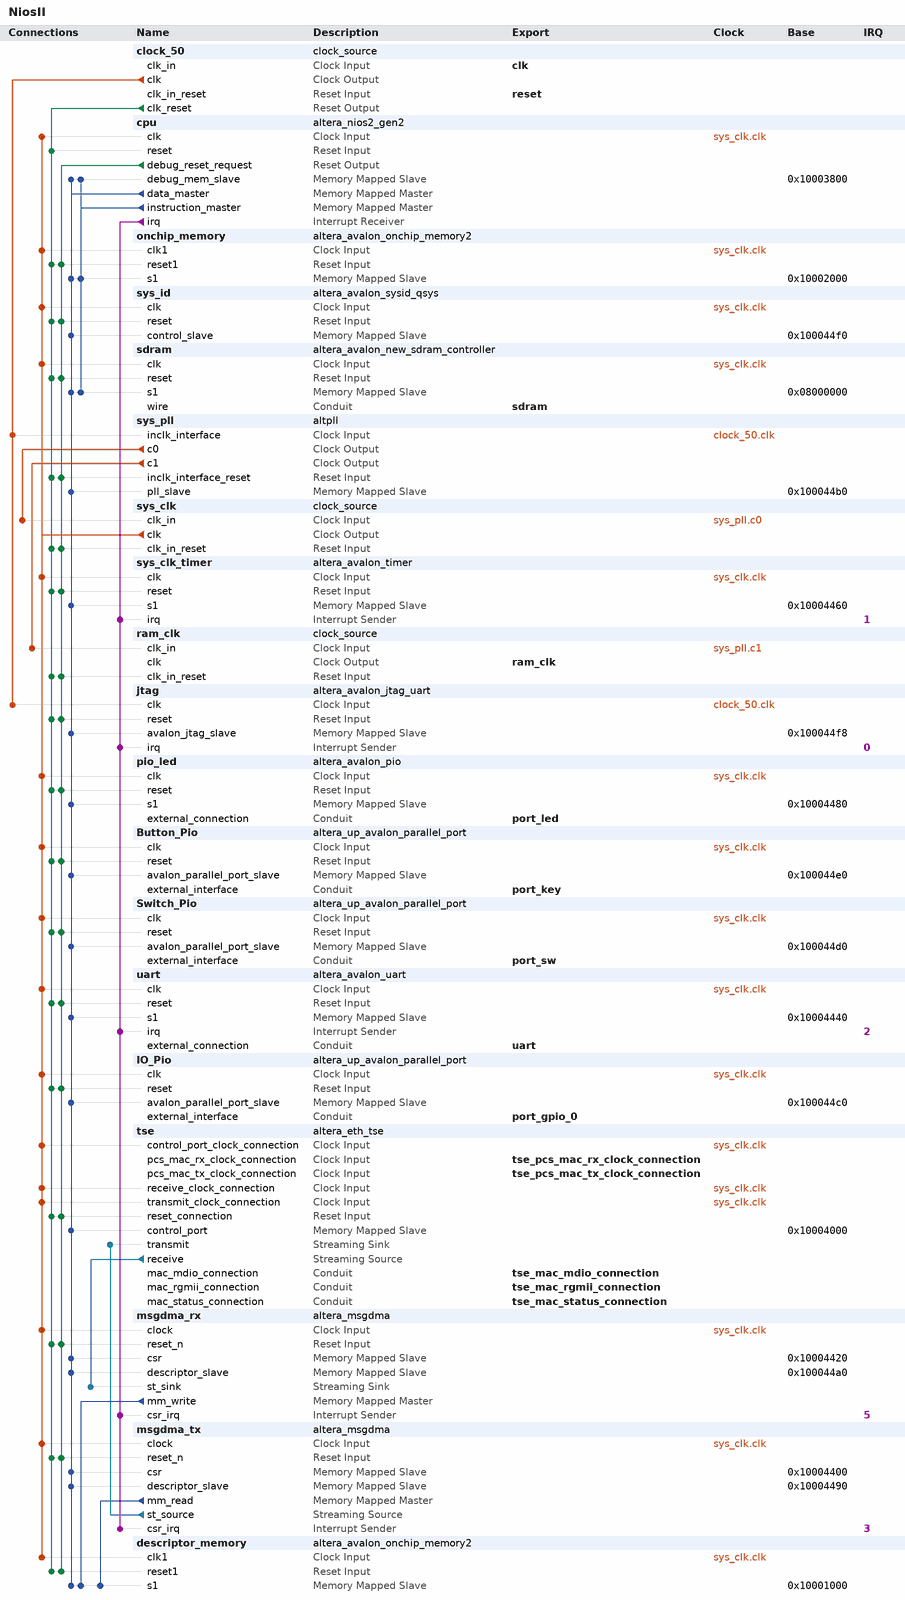
[diagram p0: system contents]
# Platform Designer (Qsys) system NiosII, Cyclone IV E EP4CE115F29C7
# Parameters at their usual value, and those the tool derives, are not listed.
package require -exact qsys 18.1
create_system NiosII
set_project_property DEVICE_FAMILY {Cyclone IV E}
set_project_property DEVICE EP4CE115F29C7

add_instance clock_50 clock_source 18.1
set_instance_parameter_value clock_50 clockFrequency 50000000

add_instance cpu altera_nios2_gen2 18.1
set_instance_parameter_value cpu dcache_size 2048
set_instance_parameter_value cpu exceptionSlave sdram.s1
set_instance_parameter_value cpu icache_size 4096
set_instance_parameter_value cpu impl Tiny
set_instance_parameter_value cpu resetSlave sdram.s1

add_instance onchip_memory altera_avalon_onchip_memory2 18.1
set_instance_parameter_value onchip_memory dataWidth 32
set_instance_parameter_value onchip_memory dualPort false
set_instance_parameter_value onchip_memory initMemContent true
set_instance_parameter_value onchip_memory initializationFileName onchip_mem.hex
set_instance_parameter_value onchip_memory memorySize 4096

add_instance sys_id altera_avalon_sysid_qsys 18.1
set_instance_parameter_value sys_id id 0

add_instance sdram altera_avalon_new_sdram_controller 18.1
set_instance_parameter_value sdram TAC 5.5
set_instance_parameter_value sdram TRCD 20.0
set_instance_parameter_value sdram TRP 20.0
set_instance_parameter_value sdram casLatency 3
set_instance_parameter_value sdram columnWidth 10
set_instance_parameter_value sdram dataWidth 32
set_instance_parameter_value sdram generateSimulationModel false
set_instance_parameter_value sdram model single_Micron_MT48LC4M32B2_7_chip
set_instance_parameter_value sdram numberOfBanks 4
set_instance_parameter_value sdram numberOfChipSelects 1
set_instance_parameter_value sdram powerUpDelay 100.0
set_instance_parameter_value sdram refreshPeriod 15.625
set_instance_parameter_value sdram rowWidth 13

add_instance sys_pll altpll 18.1
set_instance_parameter_value sys_pll CLK0_DIVIDE_BY 1
set_instance_parameter_value sys_pll CLK0_MULTIPLY_BY 2
set_instance_parameter_value sys_pll CLK1_DIVIDE_BY 1
set_instance_parameter_value sys_pll CLK1_DUTY_CYCLE 50
set_instance_parameter_value sys_pll CLK1_MULTIPLY_BY 2
set_instance_parameter_value sys_pll CLK1_PHASE_SHIFT -1667
set_instance_parameter_value sys_pll INCLK0_INPUT_FREQUENCY 20000
set_instance_parameter_value sys_pll PORT_ARESET PORT_UNUSED
set_instance_parameter_value sys_pll PORT_LOCKED PORT_UNUSED
set_instance_parameter_value sys_pll PORT_clk1 PORT_USED
set_instance_parameter_value sys_pll PORT_clk2 PORT_UNUSED
set_instance_parameter_value sys_pll PORT_clk3 PORT_UNUSED

add_instance sys_clk clock_source 18.1
set_instance_parameter_value sys_clk clockFrequency 100000000

add_instance sys_clk_timer altera_avalon_timer 18.1
set_instance_parameter_value sys_clk_timer fixedPeriod true
set_instance_parameter_value sys_clk_timer period 1
set_instance_parameter_value sys_clk_timer periodUnits MSEC

add_instance ram_clk clock_source 18.1
set_instance_parameter_value ram_clk clockFrequency 100000000

add_instance jtag altera_avalon_jtag_uart 18.1
set_instance_parameter_value jtag simInteractiveOptions NO_INTERACTIVE_WINDOWS

add_instance pio_led altera_avalon_pio 18.1
set_instance_parameter_value pio_led direction Output
set_instance_parameter_value pio_led width 8

add_instance Button_Pio altera_up_avalon_parallel_port 18.0
set_instance_parameter_value Button_Pio board DE0-Nano
set_instance_parameter_value Button_Pio capture false
set_instance_parameter_value Button_Pio edge Rising
set_instance_parameter_value Button_Pio irq false
set_instance_parameter_value Button_Pio preset Pushbuttons

add_instance Switch_Pio altera_up_avalon_parallel_port 18.0
set_instance_parameter_value Switch_Pio board DE0-Nano
set_instance_parameter_value Switch_Pio capture false
set_instance_parameter_value Switch_Pio edge Rising
set_instance_parameter_value Switch_Pio irq false
set_instance_parameter_value Switch_Pio preset {Dip Switches}

add_instance uart altera_avalon_uart 18.1
set_instance_parameter_value uart baud 115200
set_instance_parameter_value uart dataBits 8
set_instance_parameter_value uart fixedBaud true
set_instance_parameter_value uart parity NONE
set_instance_parameter_value uart stopBits 1

add_instance IO_Pio altera_up_avalon_parallel_port 18.0
set_instance_parameter_value IO_Pio board DE0-Nano
set_instance_parameter_value IO_Pio capture true
set_instance_parameter_value IO_Pio edge Rising
set_instance_parameter_value IO_Pio irq false
set_instance_parameter_value IO_Pio preset {Expansion Header}

add_instance tse altera_eth_tse 18.1
set_instance_parameter_value tse XCVR_RCFG_JTAG_ENABLE 0
set_instance_parameter_value tse XCVR_SET_CAPABILITY_REG_ENABLE 0
set_instance_parameter_value tse XCVR_SET_CSR_SOFT_LOGIC_ENABLE 0
set_instance_parameter_value tse XCVR_SET_PRBS_SOFT_LOGIC_ENABLE 0
set_instance_parameter_value tse XCVR_SET_USER_IDENTIFIER 0
set_instance_parameter_value tse core_variation MAC_ONLY
set_instance_parameter_value tse enable_hd_logic true
set_instance_parameter_value tse enable_mac_flow_ctrl false
set_instance_parameter_value tse enable_magic_detect true
set_instance_parameter_value tse enable_shift16 true
set_instance_parameter_value tse ifGMII RGMII
set_instance_parameter_value tse ing_addr 11
set_instance_parameter_value tse mdio_clk_div 40
set_instance_parameter_value tse stat_cnt_ena true
set_instance_parameter_value tse transceiver_type NONE

add_instance msgdma_rx altera_msgdma 18.1
set_instance_parameter_value msgdma_rx BURST_ENABLE 0
set_instance_parameter_value msgdma_rx DATA_FIFO_DEPTH 32
set_instance_parameter_value msgdma_rx DATA_WIDTH 32
set_instance_parameter_value msgdma_rx DESCRIPTOR_FIFO_DEPTH 128
set_instance_parameter_value msgdma_rx ENHANCED_FEATURES 0
set_instance_parameter_value msgdma_rx ERROR_ENABLE 0
set_instance_parameter_value msgdma_rx MAX_BURST_COUNT 2
set_instance_parameter_value msgdma_rx MAX_BYTE 1024
set_instance_parameter_value msgdma_rx MODE 2
set_instance_parameter_value msgdma_rx PACKET_ENABLE 1
set_instance_parameter_value msgdma_rx TRANSFER_TYPE {Aligned Accesses}

add_instance msgdma_tx altera_msgdma 18.1
set_instance_parameter_value msgdma_tx BURST_ENABLE 0
set_instance_parameter_value msgdma_tx DATA_FIFO_DEPTH 64
set_instance_parameter_value msgdma_tx DATA_WIDTH 32
set_instance_parameter_value msgdma_tx DESCRIPTOR_FIFO_DEPTH 128
set_instance_parameter_value msgdma_tx ENHANCED_FEATURES 0
set_instance_parameter_value msgdma_tx ERROR_ENABLE 0
set_instance_parameter_value msgdma_tx MAX_BURST_COUNT 2
set_instance_parameter_value msgdma_tx MAX_BYTE 1024
set_instance_parameter_value msgdma_tx MODE 1
set_instance_parameter_value msgdma_tx PACKET_ENABLE 1
set_instance_parameter_value msgdma_tx TRANSFER_TYPE {Aligned Accesses}

add_instance descriptor_memory altera_avalon_onchip_memory2 18.1
set_instance_parameter_value descriptor_memory dataWidth 32
set_instance_parameter_value descriptor_memory dualPort false
set_instance_parameter_value descriptor_memory initMemContent true
set_instance_parameter_value descriptor_memory initializationFileName onchip_mem.hex
set_instance_parameter_value descriptor_memory memorySize 4096

# connections
add_connection clock_50.clk jtag.clk clock
add_connection clock_50.clk sys_pll.inclk_interface clock
add_connection sys_clk.clk Button_Pio.clk clock
add_connection sys_clk.clk cpu.clk clock
add_connection sys_clk.clk descriptor_memory.clk1 clock
add_connection sys_clk.clk IO_Pio.clk clock
add_connection sys_clk.clk msgdma_rx.clock clock
add_connection sys_clk.clk msgdma_tx.clock clock
add_connection sys_clk.clk onchip_memory.clk1 clock
add_connection sys_clk.clk pio_led.clk clock
add_connection sys_clk.clk sdram.clk clock
add_connection sys_clk.clk Switch_Pio.clk clock
add_connection sys_clk.clk sys_clk_timer.clk clock
add_connection sys_clk.clk sys_id.clk clock
add_connection sys_clk.clk tse.control_port_clock_connection clock
add_connection sys_clk.clk tse.receive_clock_connection clock
add_connection sys_clk.clk tse.transmit_clock_connection clock
add_connection sys_clk.clk uart.clk clock
add_connection sys_pll.c0 sys_clk.clk_in clock
add_connection sys_pll.c1 ram_clk.clk_in clock
add_connection clock_50.clk_reset Button_Pio.reset reset
add_connection clock_50.clk_reset cpu.reset reset
add_connection clock_50.clk_reset descriptor_memory.reset1 reset
add_connection clock_50.clk_reset IO_Pio.reset reset
add_connection clock_50.clk_reset jtag.reset reset
add_connection clock_50.clk_reset msgdma_rx.reset_n reset
add_connection clock_50.clk_reset msgdma_tx.reset_n reset
add_connection clock_50.clk_reset onchip_memory.reset1 reset
add_connection clock_50.clk_reset pio_led.reset reset
add_connection clock_50.clk_reset ram_clk.clk_in_reset reset
add_connection clock_50.clk_reset sdram.reset reset
add_connection clock_50.clk_reset Switch_Pio.reset reset
add_connection clock_50.clk_reset sys_clk.clk_in_reset reset
add_connection clock_50.clk_reset sys_clk_timer.reset reset
add_connection clock_50.clk_reset sys_id.reset reset
add_connection clock_50.clk_reset sys_pll.inclk_interface_reset reset
add_connection clock_50.clk_reset tse.reset_connection reset
add_connection clock_50.clk_reset uart.reset reset
add_connection cpu.debug_reset_request Button_Pio.reset reset
add_connection cpu.debug_reset_request descriptor_memory.reset1 reset
add_connection cpu.debug_reset_request IO_Pio.reset reset
add_connection cpu.debug_reset_request jtag.reset reset
add_connection cpu.debug_reset_request msgdma_rx.reset_n reset
add_connection cpu.debug_reset_request msgdma_tx.reset_n reset
add_connection cpu.debug_reset_request onchip_memory.reset1 reset
add_connection cpu.debug_reset_request pio_led.reset reset
add_connection cpu.debug_reset_request ram_clk.clk_in_reset reset
add_connection cpu.debug_reset_request sdram.reset reset
add_connection cpu.debug_reset_request Switch_Pio.reset reset
add_connection cpu.debug_reset_request sys_clk.clk_in_reset reset
add_connection cpu.debug_reset_request sys_clk_timer.reset reset
add_connection cpu.debug_reset_request sys_id.reset reset
add_connection cpu.debug_reset_request sys_pll.inclk_interface_reset reset
add_connection cpu.debug_reset_request tse.reset_connection reset
add_connection cpu.debug_reset_request uart.reset reset
add_connection cpu.data_master Button_Pio.avalon_parallel_port_slave avalon
set_connection_parameter_value cpu.data_master/Button_Pio.avalon_parallel_port_slave baseAddress 0x100044e0
add_connection cpu.data_master cpu.debug_mem_slave avalon
set_connection_parameter_value cpu.data_master/cpu.debug_mem_slave baseAddress 0x10003800
add_connection cpu.data_master descriptor_memory.s1 avalon
set_connection_parameter_value cpu.data_master/descriptor_memory.s1 baseAddress 0x10001000
add_connection cpu.data_master IO_Pio.avalon_parallel_port_slave avalon
set_connection_parameter_value cpu.data_master/IO_Pio.avalon_parallel_port_slave baseAddress 0x100044c0
add_connection cpu.data_master jtag.avalon_jtag_slave avalon
set_connection_parameter_value cpu.data_master/jtag.avalon_jtag_slave baseAddress 0x100044f8
add_connection cpu.data_master msgdma_rx.csr avalon
set_connection_parameter_value cpu.data_master/msgdma_rx.csr baseAddress 0x10004420
add_connection cpu.data_master msgdma_rx.descriptor_slave avalon
set_connection_parameter_value cpu.data_master/msgdma_rx.descriptor_slave baseAddress 0x100044a0
add_connection cpu.data_master msgdma_tx.csr avalon
set_connection_parameter_value cpu.data_master/msgdma_tx.csr baseAddress 0x10004400
add_connection cpu.data_master msgdma_tx.descriptor_slave avalon
set_connection_parameter_value cpu.data_master/msgdma_tx.descriptor_slave baseAddress 0x10004490
add_connection cpu.data_master onchip_memory.s1 avalon
set_connection_parameter_value cpu.data_master/onchip_memory.s1 baseAddress 0x10002000
add_connection cpu.data_master pio_led.s1 avalon
set_connection_parameter_value cpu.data_master/pio_led.s1 baseAddress 0x10004480
add_connection cpu.data_master sdram.s1 avalon
set_connection_parameter_value cpu.data_master/sdram.s1 baseAddress 0x08000000
add_connection cpu.data_master Switch_Pio.avalon_parallel_port_slave avalon
set_connection_parameter_value cpu.data_master/Switch_Pio.avalon_parallel_port_slave baseAddress 0x100044d0
add_connection cpu.data_master sys_clk_timer.s1 avalon
set_connection_parameter_value cpu.data_master/sys_clk_timer.s1 baseAddress 0x10004460
add_connection cpu.data_master sys_id.control_slave avalon
set_connection_parameter_value cpu.data_master/sys_id.control_slave baseAddress 0x100044f0
add_connection cpu.data_master sys_pll.pll_slave avalon
set_connection_parameter_value cpu.data_master/sys_pll.pll_slave baseAddress 0x100044b0
add_connection cpu.data_master tse.control_port avalon
set_connection_parameter_value cpu.data_master/tse.control_port baseAddress 0x10004000
add_connection cpu.data_master uart.s1 avalon
set_connection_parameter_value cpu.data_master/uart.s1 baseAddress 0x10004440
add_connection cpu.instruction_master cpu.debug_mem_slave avalon
set_connection_parameter_value cpu.instruction_master/cpu.debug_mem_slave baseAddress 0x10003800
add_connection cpu.instruction_master onchip_memory.s1 avalon
set_connection_parameter_value cpu.instruction_master/onchip_memory.s1 baseAddress 0x10002000
add_connection cpu.instruction_master sdram.s1 avalon
set_connection_parameter_value cpu.instruction_master/sdram.s1 baseAddress 0x08000000
add_connection msgdma_rx.mm_write descriptor_memory.s1 avalon
set_connection_parameter_value msgdma_rx.mm_write/descriptor_memory.s1 baseAddress 0x10001000
add_connection msgdma_tx.mm_read descriptor_memory.s1 avalon
set_connection_parameter_value msgdma_tx.mm_read/descriptor_memory.s1 baseAddress 0x10001000
add_connection msgdma_tx.st_source tse.transmit avalon_streaming
add_connection tse.receive msgdma_rx.st_sink avalon_streaming
add_connection cpu.irq jtag.irq interrupt
set_connection_parameter_value cpu.irq/jtag.irq irqNumber 0
add_connection cpu.irq msgdma_rx.csr_irq interrupt
set_connection_parameter_value cpu.irq/msgdma_rx.csr_irq irqNumber 5
add_connection cpu.irq msgdma_tx.csr_irq interrupt
set_connection_parameter_value cpu.irq/msgdma_tx.csr_irq irqNumber 3
add_connection cpu.irq sys_clk_timer.irq interrupt
set_connection_parameter_value cpu.irq/sys_clk_timer.irq irqNumber 1
add_connection cpu.irq uart.irq interrupt
set_connection_parameter_value cpu.irq/uart.irq irqNumber 2

# exported interfaces
add_interface clk clock sink
set_interface_property clk EXPORT_OF clock_50.clk_in
add_interface port_gpio_0 conduit end
set_interface_property port_gpio_0 EXPORT_OF IO_Pio.external_interface
add_interface port_key conduit end
set_interface_property port_key EXPORT_OF Button_Pio.external_interface
add_interface port_led conduit end
set_interface_property port_led EXPORT_OF pio_led.external_connection
add_interface port_sw conduit end
set_interface_property port_sw EXPORT_OF Switch_Pio.external_interface
add_interface ram_clk clock source
set_interface_property ram_clk EXPORT_OF ram_clk.clk
add_interface reset reset sink
set_interface_property reset EXPORT_OF clock_50.clk_in_reset
add_interface sdram conduit end
set_interface_property sdram EXPORT_OF sdram.wire
add_interface tse_mac_mdio_connection conduit end
set_interface_property tse_mac_mdio_connection EXPORT_OF tse.mac_mdio_connection
add_interface tse_mac_rgmii_connection conduit end
set_interface_property tse_mac_rgmii_connection EXPORT_OF tse.mac_rgmii_connection
add_interface tse_mac_status_connection conduit end
set_interface_property tse_mac_status_connection EXPORT_OF tse.mac_status_connection
add_interface tse_pcs_mac_rx_clock_connection clock sink
set_interface_property tse_pcs_mac_rx_clock_connection EXPORT_OF tse.pcs_mac_rx_clock_connection
add_interface tse_pcs_mac_tx_clock_connection clock sink
set_interface_property tse_pcs_mac_tx_clock_connection EXPORT_OF tse.pcs_mac_tx_clock_connection
add_interface uart conduit end
set_interface_property uart EXPORT_OF uart.external_connection

set_interconnect_requirement {$system} qsys_mm.clockCrossingAdapter HANDSHAKE
set_interconnect_requirement {$system} qsys_mm.enableEccProtection FALSE
set_interconnect_requirement {$system} qsys_mm.insertDefaultSlave FALSE
set_interconnect_requirement {$system} qsys_mm.maxAdditionalLatency 1

save_system NiosII.qsys
